# EAGLE schematic Apo Board 2017 ATmega328_SMD (EAGLE 7.6.0)
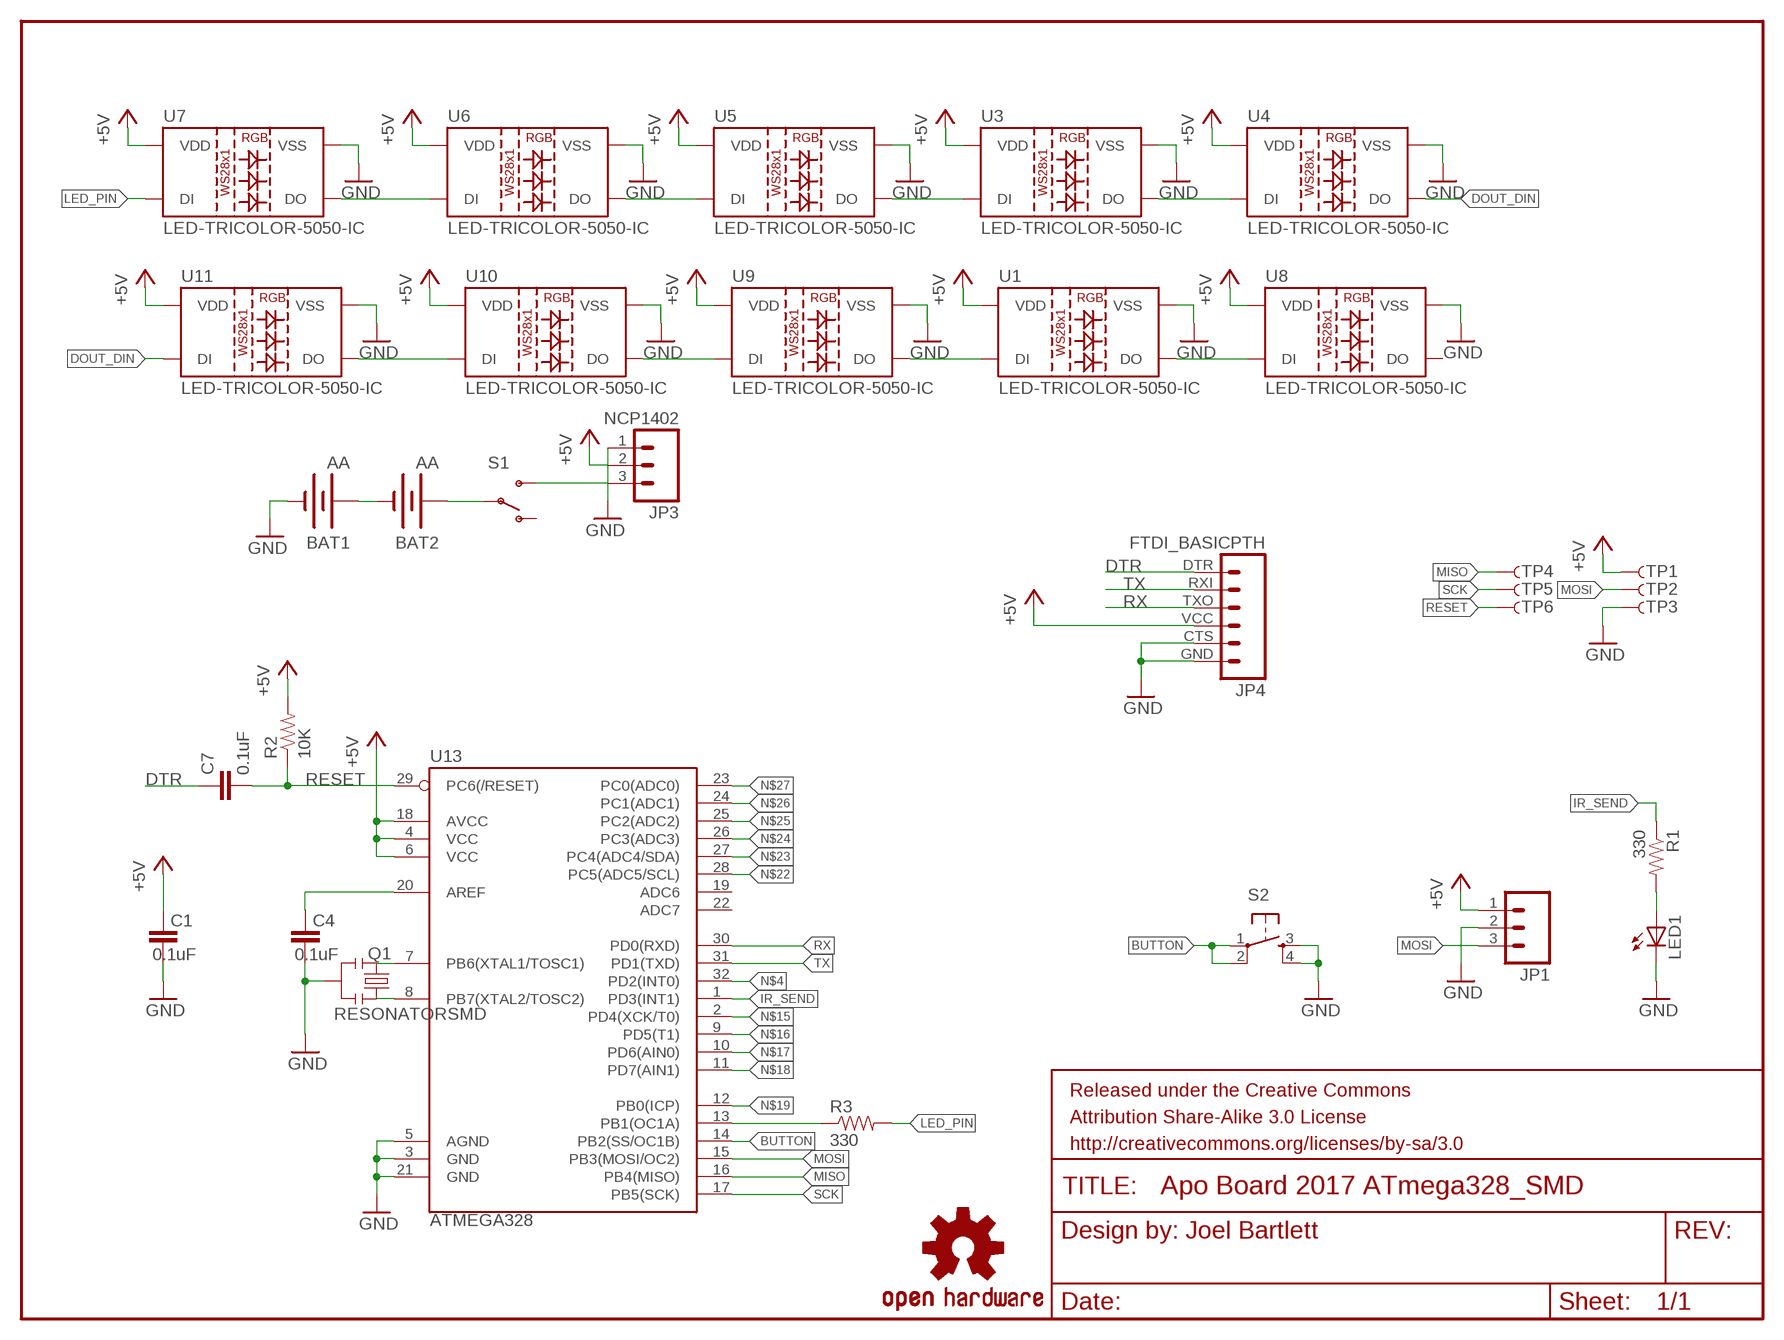
[diagram p0: schematic, sheet 1]

## Parts
BAT1  AA  BATTERYAA-KIT  [BATTERY-AA-KIT]
BAT2  AA  BATTERYAA-KIT  [BATTERY-AA-KIT]
C1  0.1uF  CAP0402-CAP  [0402-CAP]
C4  0.1uF  CAP0402-CAP  [0402-CAP]
C7  0.1uF  CAP0402-CAP  [0402-CAP]
FRAME1  FRAME-LETTER  [CREATIVE_COMMONS]
JP1  M03IR_RECEIVER  [1X03_IR_RECEIVER]
JP3  NCP1402  M03BOOST  [1X03_BOOST]
JP4  FTDI_BASICPTH  [FTDI_BASIC]
LED1  LED5MM  [LED5MM]
LOGO1  OSHW-LOGOS  [OSHW-LOGO-S]
Q1  RESONATORSMD  [RESONATOR-SMD]
R1  330  RESISTORPTH-1/4W  [AXIAL-0.4]
R2  10K  RESISTOR0402-RES  [0402-RES]
R3  330  RESISTORPTH-1/4W  [AXIAL-0.4]
S1  SWITCH-SPSTKIT  [SWITCH-SPDT_KIT]
S2  TAC_SWITCHPTH  [TACTILE-PTH]
TP1  TP-3x5  TEST-POINT3X5  [PAD.03X.05]
TP2  TP-3x5  TEST-POINT3X5  [PAD.03X.05]
TP3  TP-3x5  TEST-POINT3X5  [PAD.03X.05]
TP4  TP-3x5  TEST-POINT3X5  [PAD.03X.05]
TP5  TP-3x5  TEST-POINT3X5  [PAD.03X.05]
TP6  TP-3x5  TEST-POINT3X5  [PAD.03X.05]
U1  LED-TRICOLOR-5050-IC  [LED-RGB-THRU]
U3  LED-TRICOLOR-5050-IC  [LED-RGB-THRU]
U4  LED-TRICOLOR-5050-IC  [LED-RGB-THRU]
U5  LED-TRICOLOR-5050-IC  [LED-RGB-THRU]
U6  LED-TRICOLOR-5050-IC  [LED-RGB-THRU]
U7  LED-TRICOLOR-5050-IC  [LED-RGB-THRU]
U8  LED-TRICOLOR-5050-IC  [LED-RGB-THRU]
U9  LED-TRICOLOR-5050-IC  [LED-RGB-THRU]
U10  LED-TRICOLOR-5050-IC  [LED-RGB-THRU]
U11  LED-TRICOLOR-5050-IC  [LED-RGB-THRU]
U13  ATMEGA328  ATMEGA168  [TQFP32-08]

## Nets
+5V: C1.2 JP1.1 JP3.2 JP4.VCC R2.2 TP1.P$1 U1.2(VDD) U3.2(VDD) U4.2(VDD) U5.2(VDD) U6.2(VDD) U7.2(VDD) U8.2(VDD) U9.2(VDD) U10.2(VDD) U11.2(VDD) U13.4(VCC) U13.6(VCC) U13.18(AVCC)
AREF: C4.2 U13.20(AREF)
BUTTON: S2.1 S2.2 U13.14(PB2(SS/OC1B))
DOUT_DIN: U4.4(DO) U11.1(DI)
DTR: C7.1 JP4.DTR
GND: BAT1.GND@1(-) C1.1 C4.1 JP1.2 JP3.1 JP4.CTS JP4.GND LED1.K(C) Q1.2 S2.3 S2.4 TP3.P$1 U1.3(VSS) U3.3(VSS) U4.3(VSS) U5.3(VSS) U6.3(VSS) U7.3(VSS) U8.3(VSS) U9.3(VSS) U10.3(VSS) U11.3(VSS) U13.3(GND) U13.5(AGND) U13.21(GND)
IR_SEND: R1.P$1 U13.1(PD3(INT1))
LED_PIN: R3.P$2 U7.1(DI)
MISO: TP4.P$1 U13.16(PB4(MISO))
MOSI: JP1.3 TP2.P$1 U13.15(PB3(MOSI/OC2))
N$1: U6.1(DI) U7.4(DO)
N$2: U5.1(DI) U6.4(DO)
N$3: LED1.A R1.P$2
N$4: U13.32(PD2(INT0))
N$5: U3.1(DI) U5.4(DO)
N$6: U3.4(DO) U4.1(DI)
N$7: BAT2.PWR@1(+) S1.2(P)
N$8: JP3.3 S1.3(S)
N$9: U10.1(DI) U11.4(DO)
N$10: BAT1.PWR@1(+) BAT2.GND@1(-)
N$11: U9.1(DI) U10.4(DO)
N$13: U1.1(DI) U9.4(DO)
N$14: U1.4(DO) U8.1(DI)
N$15: U13.2(PD4(XCK/T0))
N$16: U13.9(PD5(T1))
N$17: U13.10(PD6(AIN0))
N$18: U13.11(PD7(AIN1))
N$19: U13.12(PB0(ICP))
N$20: R3.P$1 U13.13(PB1(OC1A))
N$22: U13.28(PC5(ADC5/SCL))
N$23: U13.27(PC4(ADC4/SDA))
N$24: U13.26(PC3(ADC3))
N$25: U13.25(PC2(ADC2))
N$26: U13.24(PC1(ADC1))
N$27: U13.23(PC0(ADC0))
N$29: Q1.1 U13.8(PB7(XTAL2/TOSC2))
N$30: Q1.3 U13.7(PB6(XTAL1/TOSC1))
RESET: C7.2 R2.1 TP6.P$1 U13.29(PC6(/RESET))
RX: JP4.TXO U13.30(PD0(RXD))
SCK: TP5.P$1 U13.17(PB5(SCK))
TX: JP4.RXI U13.31(PD1(TXD))
Unconnected: S1.1(O) U8.4(DO) U13.19(ADC6) U13.22(ADC7)

## Notes on the sheet
- Joel Bartlett

## Library data of the parts
BAT1 BAT2 = SparkFun:BATTERY: Battery Holders Various common sizes : AA, AAA, 20mm coin cell and 12mm coin cell.
C1 C4 C7 = SparkFun:CAP: Capacitor Standard 0603 ceramic capacitor, and 0.1" leaded capacitor.
FRAME1 = SparkFun-Aesthetics:FRAME-LETTER: Schematic Frame Standard 8.5x11 US Letter frame
JP1 JP3 = SparkFun-Connectors:M03: Header 3 Standard 3-pin 0.1" header. Use with straight break away headers (SKU : PRT-00116), right angle break away headers (PRT-00553), swiss pins (PRT-00743), machine pins (PRT-00117), and female headers (PRT-00115). Molex polarized connector foot print use with SKU : PRT-08232 with associated crimp pins and housings.
JP4 = SparkFun-Connectors:FTDI_BASIC: FTDI Basic header with labels
LED1 = SparkFun-LED:LED: LEDs Standard schematic elements and footprints for 5mm, 3mm, 1206, and 0603 sized LEDs. 5mm - Spark Fun Electronics SKU : COM-00529 (and others)
LOGO1 = SparkFun-Aesthetics:OSHW-LOGO: Open Source Hardware Logo This logo indicates the piece of hardware it is found on incorporates a OSHW license and/or adheres to the definition of open source hardware found here: http://freedomdefined.org/OSHW
Q1 = SparkFun:RESONATOR: Resonator Small SMD resonator. This is the itty bitty 10/20MHz resonators with built in caps. CSTCE10M0G55 and CSTCE20M0V53. Footprint has been reviewed closely but hasn't been tested yet.
R1 R3 = SparkFun-Resistors:RESISTOR: Resistor Basic schematic elements and footprints for 0603, 1206, and PTH resistors.
R2 = SparkFun:RESISTOR: Resistor Basic schematic elements and footprints for 0603, 1206, and PTH resistors.
S1 = SparkFun:SWITCH-SPST: SPST Switch Simple slide switch. Spark Fun Electronics SKU : COM-00102
S2 = SparkFun-Electromechanical:TAC_SWITCH: Momentary Switch Button commonly used for reset or general input. Spark Fun Electronics SKU : COM-00097 SMT- SWCH-08247
TP1-TP6 = SparkFun-Passives:TEST-POINT: Bare copper test points for troubleshooting or ICT
U1 U3-U11 = SparkFun-LED:LED-TRICOLOR-5050-IC: WS2811 RGB LED w/driver 5x5mm SMD LED with built-in controller IC. DIO-11598
U13 = SparkFun:ATMEGA168

## Net classes
0 default: width 0.152 mm, drill 0.305 mm, clearance 0.152 mm
1 vcc: width 0.254 mm
3 ButtonSignal: width 0.254 mm